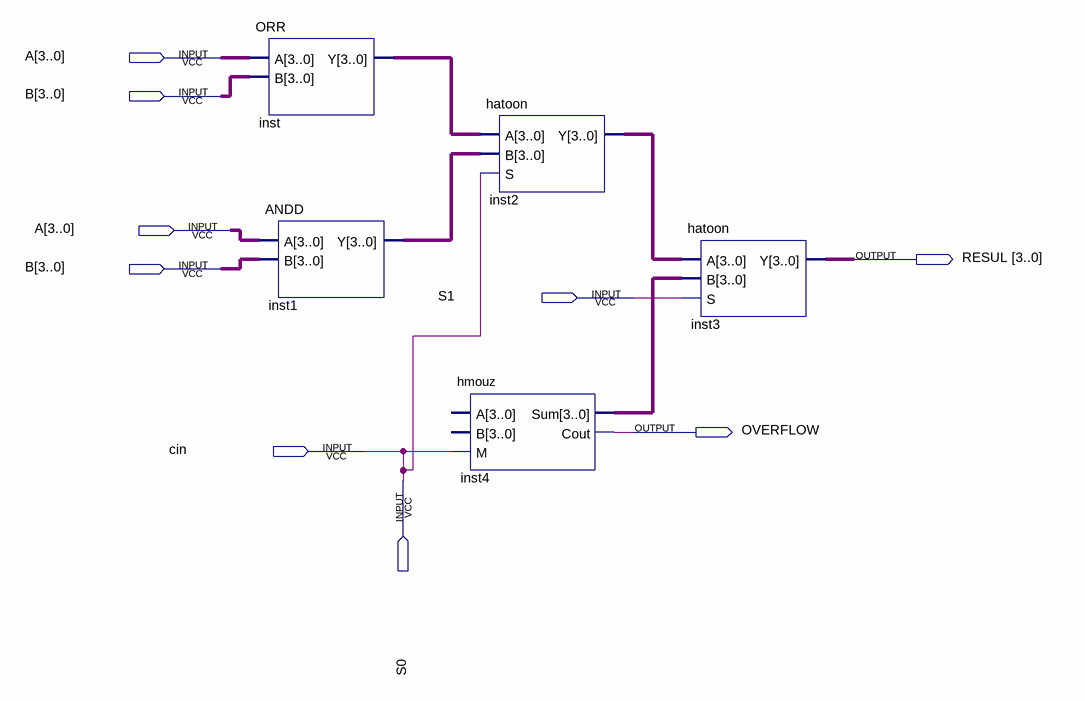
[diagram p0: schematic sheet]
// Quartus schematic h1241706block.bdf as structural Verilog: 5 symbols, 9 pins
module h1241706block (
  input  [3:0] A,
  input  [3:0] B,
  input  S1,
  input  cin,
  input  S0,
  output [3:0] RESUL,
  output OVERFLOW
);

  wire [3:0] inst1_y, inst2_y, inst4_sum, inst_y;

  ORR inst (.A(A), .B(B), .Y(inst_y));
  ANDD inst1 (.A(A), .B(B), .Y(inst1_y));
  hatoon inst2 (.A(inst_y), .B(inst1_y), .S(cin), .Y(inst2_y));
  hmouz inst4 (.M(cin), .Sum(inst4_sum), .Cout(OVERFLOW));  // open: A, B
  hatoon inst3 (.A(inst2_y), .B(inst4_sum), .S(S1), .Y(RESUL));

  assign S0 = cin;
endmodule
